# Altium schematic sheet SCH_Wojcik.SchDoc: System kontrolno-pomiarowy pracujący z użyciem łączności ZigBee
size A3; Author: Jagienka Wójcik; DrawnBy: Wójcik Jagienka; SheetNumber: 1; SheetTotal: 1
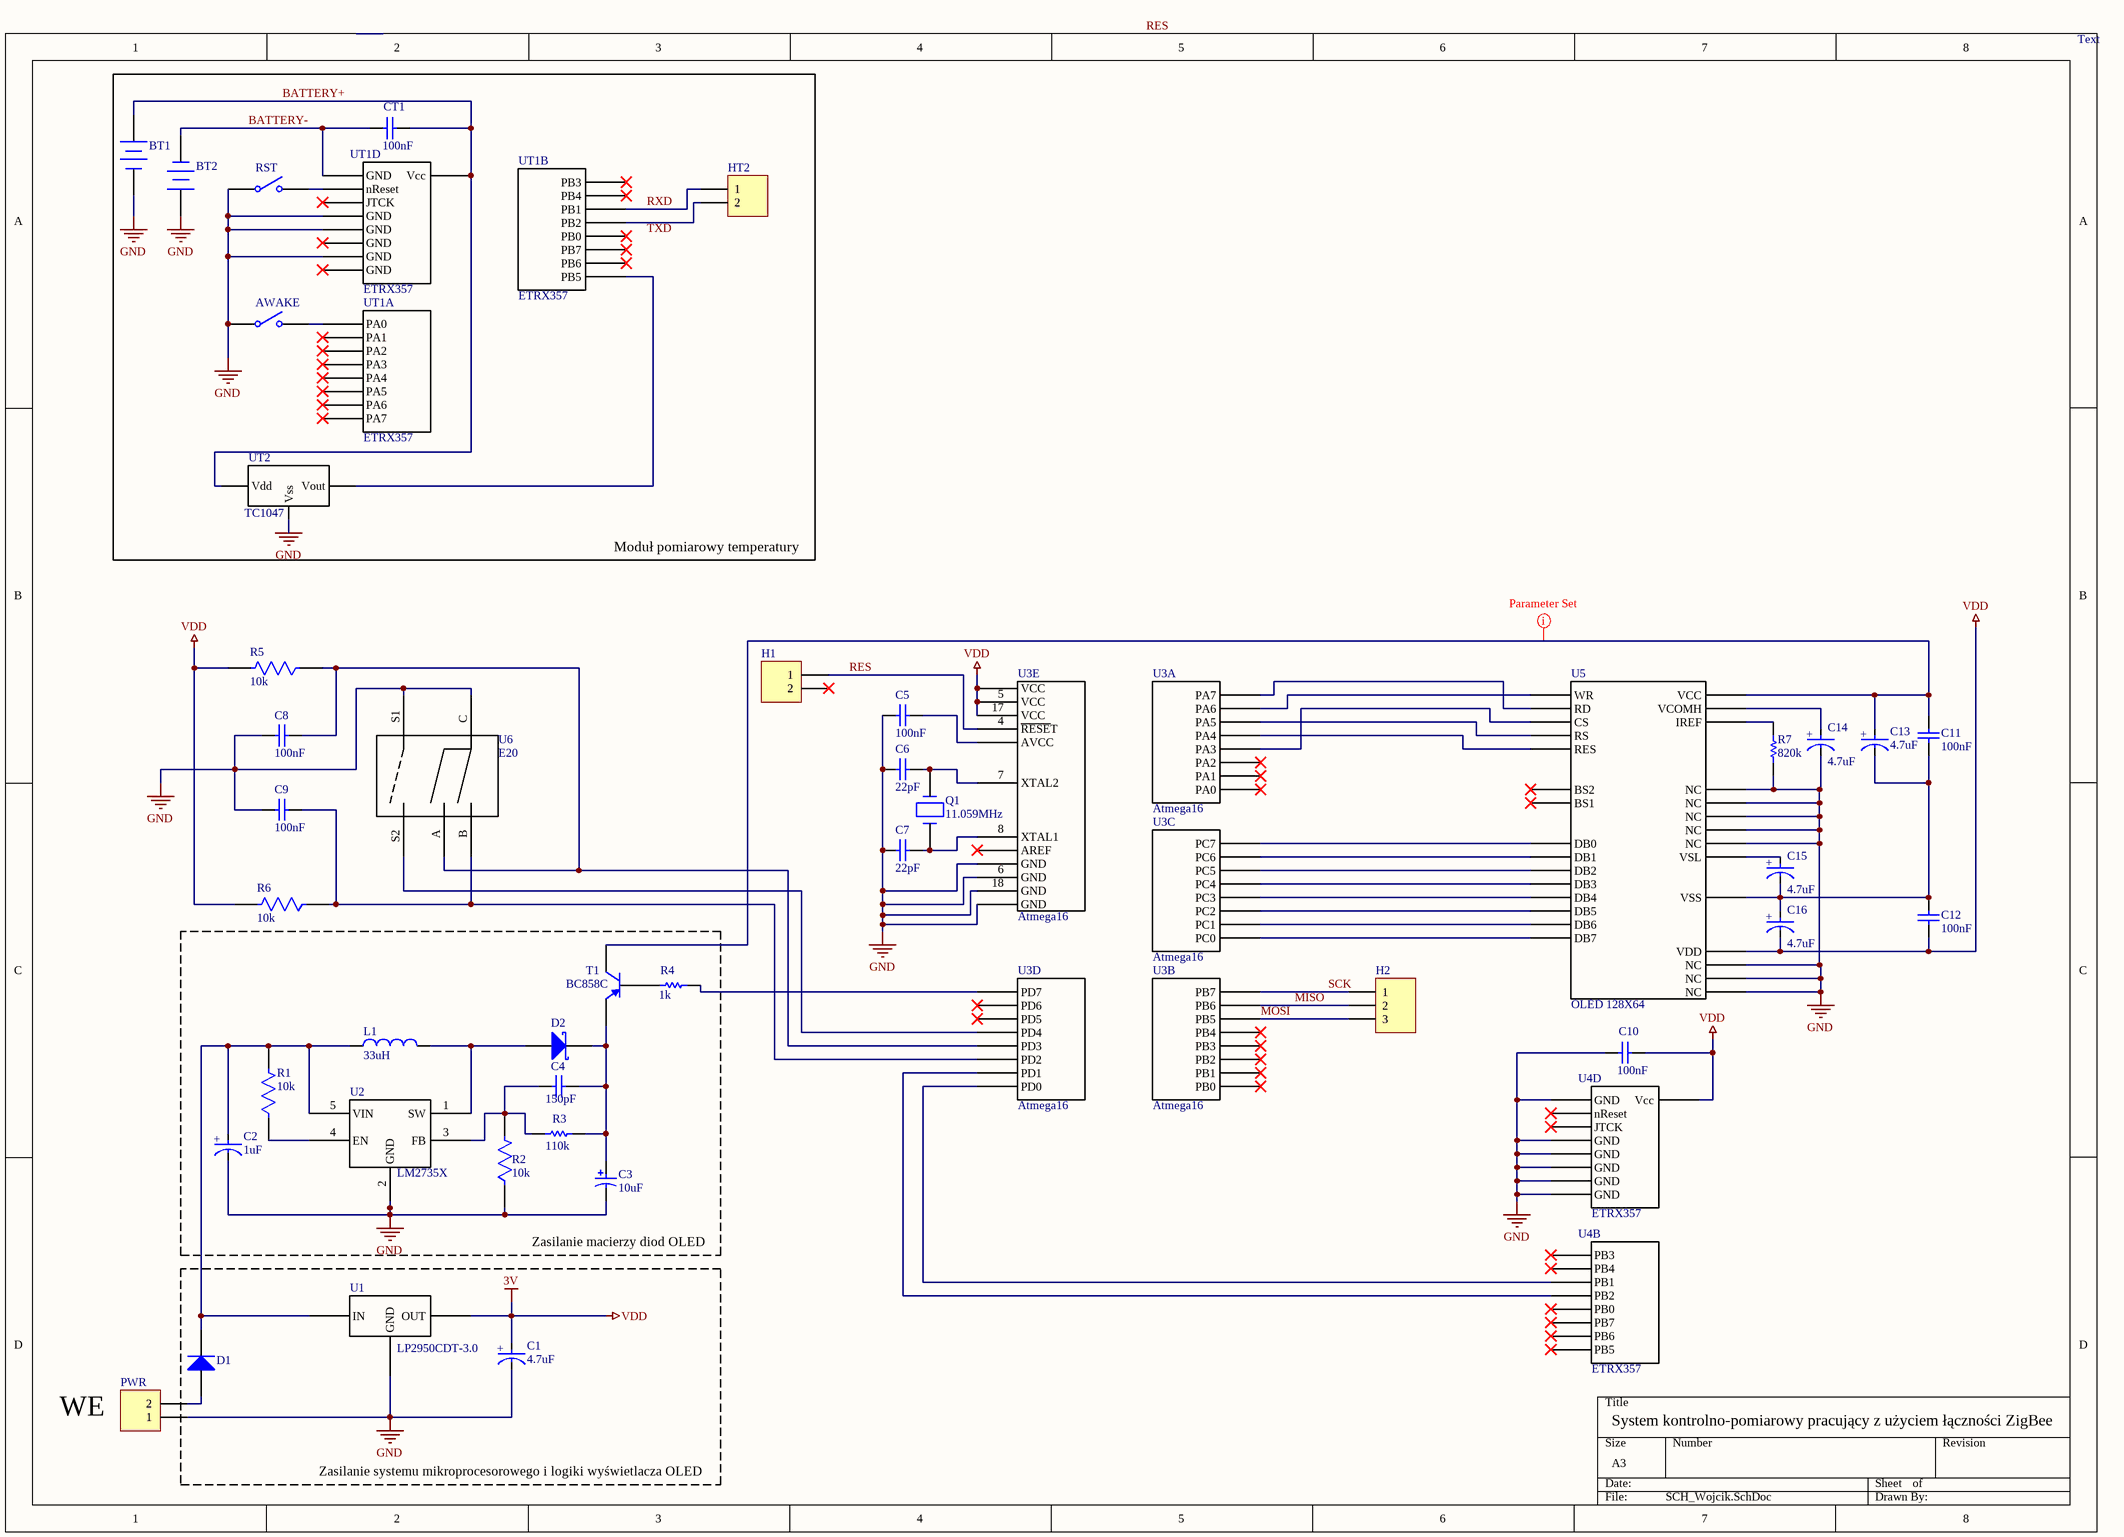
[diagram p0: SCH_Wojcik.SchDoc]

## Parts
AWAKE  (no value)  [SPST-2]
BT1  Battery  [BAT-2]  (value not drawn)
BT2  Battery  [BAT-2]  (value not drawn)
C1  4.7uF  [FP-TAJB-MFG]
C2  1uF  [FP-TAJB-MFG]
C3  10uF  [CAPMP3529X21-T_V]
C4  150pF  [CAPC1608X90X35LL15T15]
C5  100nF  [CAPC1608X90X35LL10T15]
C6  22pF  [CAPC1005X56X25LL10T15]
C7  22pF  [CAPC1005X56X25LL10T15]
C8  100nF  [CAPC1608X90X35LL10T15]
C9  100nF  [CAPC1608X90X35LL10T15]
C10  100nF  [CAPC1608X90X35LL10T15]
C11  100nF  [CAPC1608X90X35LL10T15]
C12  100nF  [CAPC1608X90X35LL10T15]
C13  4.7uF  [FP-TAJB-MFG]
C14  4.7uF  [FP-TAJB-MFG]
C15  4.7uF  [FP-TAJB-MFG]
C16  4.7uF  [FP-TAJB-MFG]
CT1  100nF  [CAPC1608X90X35LL10T15]
D1  Diode 1N5407  [DO-201AD]  (value not drawn)
D2  D Schottky  [SMB]  (value not drawn)
H1  Header 2  [HDR1X2]  (value not drawn)
H2  Header 3  [HDR1X3]  (value not drawn)
HT2  Header 2  [HDR1X2]  (value not drawn)
L1  33uH  [WE-PD4-L]
PWR  Header 2  [HDR1X2]  (value not drawn)
Q1  11.059MHz  [XTAL_ABLS2-11.059MHZ-B4Y-T]
R1  10k  [FP-CRCW0402-e3-IPC_A]
R2  10k  [FP-CRCW0402-e3-IPC_A]
R3  110k  [RESC1005X40X25LL05T05]
R4  1k  [RESC2013X50X30LL20T20]
R5  10k  [FP-CRCW0402-e3-IPC_A]
R6  10k  [FP-CRCW0402-e3-IPC_A]
R7  820k  [RESC1005X40X25NL05T05]
RST  (no value)  [SPST-2]
T1  BC858C  [INF-SOT23_L]
U1  LP2950CDT-3.0  [ON_Semi_369C_0]
U2  LM2735X  [SOT95P280X145-5N]
U3  Atmega16  [44A_L]  (parts A,B,C,D,E of 5)
U4  ETRX357  [ETRX357]  (parts B,D of 4)
U5  OLED 128X64
U6  E20  [Encoder]
UT1  ETRX357  [ETRX357]  (parts A,B,D of 4)
UT2  TC1047  [SOT-23]

## Blocks framed on the sheet
Moduł pomiarowy temperatury: AWAKE BT1 BT2 CT1 HT2 RST UT1 UT2
Zasilanie macierzy diod OLED: C2-C4 D2 L1 R1-R4 T1 U2

## Nets
3V: C1.2(A) C10.2 C12.1 C16.1(C) R5.2 R6.2 U1.3(OUT) U3.5(VCC) U3.17(VCC) U3.38(VCC) U4.32(Vcc) U5.21(VDD)  [also labelled VDD]
GND: AWAKE.1(COMMON) BT1.2(-) BT2.1(+) C1.1(C) C2.1(C) C3.2 C5.1 C6.1 C7.1 C8.1 C9.1 C10.1 C14.1(C) PWR.1 R2.1 R7.1 RST.1(COMMON) U1.2(GND) U2.2(GND) U3.6(GND) U3.18(GND) U3.28(GND) U3.39(GND) U4.1(GND) U4.13(GND) U4.19(GND) U4.20(GND) U4.31(GND) U4.33(GND) U5.18(NC) U5.22(NC) U5.23(NC) U5.24(NC) U5.25(NC) U5.26(NC) U5.27(NC) U5.28(NC) U6.C U6.S1 UT1.13(GND) UT1.20(GND) UT1.33(GND) UT2.3(Vss)
BATTERY+: BT1.1(+) CT1.2 UT1.32(Vcc) UT2.1(Vdd)
BATTERY-: BT2.2(-) CT1.1 UT1.1(GND)
MISO: H2.2 U3.2(PB6)
MOSI: H2.3 U3.1(PB5)
RES: H1.1 U3.4(~{RESE}T)
RXD: HT2.1 UT1.17(PB1)
SCK: H2.1 U3.3(PB7)
NetAWAKE_2: AWAKE.2(NO) UT1.9(PA0)
NetC2_2: C2.2(A) D1.2(K) L1.1 R1.2 U1.1(IN) U2.5(VIN)
NetC3_1: C3.1 C4.2 D2.2(K) R3.2 T1.2(E)
NetC4_1: C4.1 R2.2 R3.1 U2.3(FB)
NetC5_2: C5.2 U3.27(AVCC)
NetC6_2: C6.2 Q1.2 U3.7(XTAL2)
NetC7_2: C7.2 Q1.1 U3.8(XTAL1)
NetC8_2: C8.2 R5.1 U3.17(PD3) U6.A
NetC9_2: C9.2 R6.1 U3.11(PD2) U6.B
NetC11_1: C11.1 C12.2 C13.1(C) C15.1(C) C16.2(A) U5.29(VSS)
NetC11_2: C11.2 C13.2(A) T1.3(C) U5.2(VCC)
NetC14_2: C14.2(A) U5.3(VCOMH)
NetC15_2: C15.2(A) U5.30(VSL)
NetD1_1: D1.1(A) PWR.2
NetD2_1: D2.1(A) L1.2 U2.1(SW)
NetHT2_2: HT2.2 UT1.18(PB2)
NetR1_1: R1.1 U2.4(EN)
NetR4_1: R4.1 T1.1(B)
NetR4_2: R4.2 U3.16(PD7)
NetR7_2: R7.2 U5.4(IREF)
NetRST_2: RST.2(NO) UT1.7(nReset)
NetU3_9: U3.9(PD0) U4.17(PB1)
NetU3_10: U3.10(PD1) U4.18(PB2)
NetU3_12: U3.12(PD4) U6.S2
NetU3_19: U3.19(PC0) U5.5(DB7)
NetU3_20: U3.20(PC1) U5.6(DB6)
NetU3_21: U3.21(PC2) U5.7(DB5)
NetU3_22: U3.22(PC3) U5.8(DB4)
NetU3_23: U3.23(PC4) U5.9(DB3)
NetU3_24: U3.24(PC5) U5.10(DB2)
NetU3_25: U3.25(PC6) U5.11(DB1)
NetU3_26: U3.26(PC7) U5.12(DB0)
NetU3_30: U3.30(PA7) U5.13(RD)
NetU3_31: U3.31(PA6) U5.14(WR)
NetU3_32: U3.32(PA5) U5.17(RS)
NetU3_33: U3.33(PA4) U5.26(RES)
NetU3_34: U3.34(PA3) U5.15(CS)
NetUT1_30: UT1.30(PB5) UT2.2(Vout)

Not connected (* = marked no-connect by the designer): H1 2*; U3 14(PD5)* 15(PD6)* 29(AREF)* 35(PA2)* 36(PA1)* 37(PA0)* 40(PB0)* 41(PB1)* 42(PB2)* 43(PB3)* 44(PB4)*; U4 6(PB3)* 7(nReset)* 8(PB4)* 21(JTCK)* 25(PB0)* 28(PB7)* 29(PB6)* 30(PB5)*; U5 19(BS2)* 20(BS1)*; UT1 5(PA7)* 6(PB3)* 8(PB4)* 10(PA1)* 11(PA2)* 12(PA3)* 14(PA4)* 15(PA5)* 16(PA6)* 19(GND)* 21(JTCK)* 25(PB0)* 28(PB7)* 29(PB6)* 31(GND)*

## Layout directives
rule Width Constraint [Pref Width = 12mil    Min Width = 6mil    Max Width = 50mil]: NetC11_2

## Notes on the sheet
- Text
- WE
- Zasilanie systemu mikroprocesorowego i logiki wyświetlacza OLED
- System kontrolno-pomiarowy pracujący z użyciem łączności ZigBee
- Labels drawn without touching a wire or pin: RES, TXD
- (in symbol 1uF) +
- (in symbol cap4.7u) +

## Library data of the parts
AWAKE RST = SW-SPST: Single-Pole, Single-Throw Switch; Published: 24-Mar-1999; LatestRevisionDate: 17-Jul-2002; LatestRevisionNote: Re-released for DXP Platform.; PackageReference: SPST-2; Publisher: Altium Limited; PackageDescription: Switch; 2 Leads
BT1 BT2 = Battery: Multicell Battery; Published: 24-Mar-1999; LatestRevisionDate: 17-Jul-2002; LatestRevisionNote: Re-released for DXP Platform.; PackageReference: BAT-2; Publisher: Altium Limited; PackageDescription: Battery; 2 Leads
C1 C13-C16 = cap4.7u: CAP TANT 4.7UF 10% 10V 1411; Manufacturer: AVX Corporation; Manufacturer Part Number: TAJB475K010RNJ; Life: 1000Hours; Material: Tantalum; Ripple Current: 146mA; Esr: 4Ω; Dissipation Factor: 6%; Footprint Url: https://www.avx.com/docs/techinfo/TechSumAppGuide.pdf; Category: Cap; Device Class L1: Passive Components; ComponentLink2URL: http://datasheets.avx.com/TAJ.pdf; Height: 2.1mm; RoHS: TRUE; Automotive: No; Value: 4.7uF; Temperature: -55°C to +125°C; Lead Free: Yes; Digikey Description: CAP TANT 4.7UF 10% 10V 1411; Voltage Rating: 10V; Package: TAJB; Device Class L2: Capacitors; Mouser Description: Cap Tant Solid 4.7uF 10V B CASE 10% (3.5 X 2.8 X 1.9mm) SMD 3528-21 4 Ohm 125 C T/R; ComponentLink2Description: Datasheet; Device Class L3: Tantalum Capacitors; Tolerance: 10%; Temperature Range High: +125°C; Temperature Range Low: -55°C; Octopart: https://octopart.com/tajb475k010rnj-avx-2636133; Capacitance: 4.7uF
C2 = 1uF: CAP TANT 1UF 10% 35V 1411; Dielectric Material: Tantalum; Dissipation Factor: 4%; ESR (Equivalent Series Resistance): 6.5R; Q Factor: 4; Leakage Current: 500nA; Polarity: Polar; Case Code (Metric): 3528; Tolerance: 10%; Length: 3.5mm; Voltage Rating: 35V; RoHS Compliant: Yes; Height: 1.9mm; Packaging: Tape and Reel; Max Operating Temperature: 125°C; REACH SVHC: No SVHC; Lead Free: Lead Free; Series: TAJ; Capacitance: 1uF; Package Quantity: 1; Voltage Rating (DC): 35V; Height - Seated (Max): 0.083inch; Construction: Flat; Mount: Surface Mount; Case/Package: 1210; Features: General Purpose; Voltage: 35V; Min Operating Temperature: -55°C; Radiation Hardening: No; Case Code (Imperial): 1210; Width: 2.8mm; Number of Pins: 2; Depth: 2.8mm; Termination: SMD/SMT; Lead Pitch: 1.4mm
C3 = 10uF: Standard Tantalum, 10 uF, +/- 20%, 20 V, -55 to 125 degC, 2-Pin SMD, RoHS, Tape and Reel; Manufacturer: AVX; ESR: 2.1ohm; DCL: 2uA; Case Style: Molded; DF: 6%; Product Height (mm): 1.9mm; Lead Spacing (nom): NotRequiredmm; Wire Form: NotRequired; Rad Hardened: No; Capacitance: 10000000pF; Product Depth (mm): 2.8mm; Polarity: Polar; Voltage: 20VDC; Product Length (mm): 3.5mm; Mounting Technology: SurfaceMount; Length W/Weld: NotRequiredmm; Datasheet URL: http://datasheets.avx.com/TAJ.pdf; Tolerance (+ or -): 20%; Operating Temp Range: -55Cto125C; Datasheet Version: 02/2016; Product Diameter (mm): NotRequiredmm; Manufacturer URL: http://www.avx.com/; Package Reference: CAPMP3529X21-T; Length W/Weld (max): NotRequiredmm; Insulation: NotRequired; Package / Case: 3528-21; Seal: NotRequired; Package URL: http://www.avx.com/download/software/literature/AVX-Footprint-Library.pdf; Construction: SMTChip; Packaging: TapeandReel; Package Description: 2-Pin Surface Mount Device, Body 3.5 x 2.85 mm; Case Code: B; Failure Rate: NotRequired; Seated Plane Height: NotRequiredmm; Mounting Style: SurfaceMount
C4 = 150pF: Manufacturer: Kemet; Part Number: C0603C151J5GAC7867
C5 C8-C12 CT1 = cap100n: Chip Capacitor, 0.1 uF, +/- 10%, 50 V, -55 to 125 degC, 0603 (1608 Metric), RoHS, Tape and Reel; Manufacturer: Murata; Dielectric Material: Ceramic; Voltage Rating: 50V; Dielectric: X7R; Insulation Resistance: 10GR; Case Code (Metric): 1608; Lead Free: LeadFree; Depth: 0.8mm; Number of Pins: 2; Radiation Hardening: No; Case/Package: 0603; Manufacturer URL: http://www.murata.com/; Packaging: TapeandReel; Length: 1.6mm; Contact Plating: Tin; Datasheet URL: http://psearch.en.murata.com/capacitor/product/GRM188R71H104KA93%23.pdf; Tolerance: 10%; Case Code (Imperial): 0603; Min Operating Temperature: -55degC; RoHSCompliant: true; Capacitance: 100nF; Voltage: 50V; Termination: SMD/SMT; Mount: SurfaceMount; Material: Ceramic; Package Quantity: 1; Height: 0.8mm; Thickness: 0.035inch; REACH SVHC: NoSVHC; Max Operating Temperature: 125degC; Width: 0.8mm; Package Reference: 0603; Voltage Rating (DC): 50V; Datasheet Version: 42675.0; Package Description: 2-Pin Surface Mount Device, Body 1.6 x 0.8 mm
C6 C7 = 22pF: Part Number: 04025A220JAT2A; Manufacturer: AVX Interconnect / Elco
D1 = Diode 1N5407: 3 Amp Medium Power Silicon Rectifier Diode; Published: 8-Jun-2000; LatestRevisionDate: 17-Jul-2002; LatestRevisionNote: Re-released for DXP Platform.; DatasheetVersion: Aug-1984; PackageReference: DO-201AD; Publisher: Altium Limited; PackageDescription: Diode, Axial; Body 9.5 x 5.3 mm (LxDia. max), Lead Dia. 1.32 mm (max); ComponentLink1Description: Manufacturer Link; ComponentLink1URL: http://www.irf.com/
D2 = D Schottky: Schottky Diode; Published: 8-Jun-2000; LatestRevisionDate: 17-Jul-2002; LatestRevisionNote: Re-released for DXP Platform.; PackageReference: SMB; Publisher: Altium Limited; PackageDescription: DO-214-AA/SMB; 2 C-Bend Leads; Body 5.3 x 3.6 mm, inc. leads (LxW); Code_JEDEC: DO-214-AA
H1 HT2 PWR = Header 2: Header, 2-Pin; LatestRevisionDate: 17-Jul-2002; LatestRevisionNote: Re-released for DXP Platform.; Publisher: Altium Limited
H2 = Header 3: Header, 3-Pin; LatestRevisionDate: 17-Jul-2002; LatestRevisionNote: Re-released for DXP Platform.; Publisher: Altium Limited
L1 = CMP-0227-00804-1: SMD-Power Inductor WE-PD4, L = 33.0 µH; Inductance: 33.0 ÂµH; ComponentLink2Description: Datasheet; DatasheetVersion: ver 2, Sep-2006; ComponentLink2URL: http://www.we-online.de/katalog/media/pdf/74456133.pdf; ComponentLink1Description: Manufacturer Link; PackageReference: WE-PD4-L; PackageVersion: 2006; PackageDescription: SMD Inductor, 2-Leads, Body 12.7 x 10.0 mm; ComponentLink1URL: http://www.we-online.com
Q1 = ABLS2-11.059MHZ-B4Y-T: 11.059MHz Â±30ppm Crystal 18pF 50 Ohms HC-49/US; MF: Abracon; Digi-Key_Part_Number: ABLS2-11.059MHZ-B4Y-T-ND; SnapEDA_Link: https://www.snapeda.com/parts/ABLS2-11.059MHZ-B4Y-T/Abracon%20LLC/view-part/481443/?ref=snap; Package: HC49/US Abracon; MP: ABLS2-11.059MHZ-B4Y-T; Value: *; Digi-Key_Purchase_URL: https://www.digikey.com/product-detail/en/abracon-llc/ABLS2-11.059MHZ-B4Y-T/ABLS2-11.059MHZ-B4Y-T-ND/4866046?utm_source=snapeda&utm_medium=aggregator&utm_campaign=symbol
R1 R2 R5 R6 = 10k: RES SMD 10K OHM 1% 1/16W 0402; Power Rating: 63mW; Resistance: 10kR; Voltage Rating: 50V; Temperature Coefficient: 100ppm/°C; Case Code (Metric): 1005; Features: Automotive AEC-Q200; Termination: SMD/SMT; Mount: Surface Mount; Package Quantity: 10; Packaging: Tape and Reel; Case Code (Imperial): 0402; Weight: 2.3E-05oz; Lead Free: Lead Free; Width: 0.02inch; Max Power Dissipation: 63mW; Tolerance: 1%; Number of Terminations: 2; Height: 0.35mm; Number of Pins: 2; Composition: Thick Film; Length: 1mm; Voltage Rating (DC): 50V; Case/Package: 0402; Radiation Hardening: No; Contact Plating: Tin; Depth: 0.5mm; Military Standard: Not; Min Operating Temperature: -55°C; Max Operating Temperature: 155°C
R3 = 110k: Manufacturer: Vishay Dale; Part Number: CRCW0402110KFKED
R4 = 1k: Part Number: CRCW08051K00FKEA; Manufacturer: Vishay Dale
R7 = 820k: Part Number: CRCW0402820KFKED; Manufacturer: Vishay Dale
T1 = CMP-1177-00041-1: PNP Silicon AF Transistor, 30 V VCEO, 100 mA IC, SOT23, Reel, Green; Manufacturer: Infineon; VCBO (max): 30Â V; VEBO (max): 5Â V; ICM (max): 200Â mA; Ptot (max): 330Â mW; Green: TRUE; fT (typ): 250Â MHz; IC (max): 100Â mA; ICBO (max): 15Â nA; ComponentLink1URL: http://www.infineon.com/; VCEO (max): 30Â V; ComponentLink1Description: Manufacturer URL; PartNumber: BC858C; ComponentLink3URL: http://www.infineon.com/dgdl/SOT23-Package_Overview.pdf?folderId=db3a30431936bc4b0119532290053c66&fileId=db3a30431936bc4b0119533468123c85; Mounting Technology: Surface Mount; PackageVersion: Apr-08; ComponentLink2Description: Datasheet; PackageReference: SOT23; ComponentLink3Description: Package Specification; ComponentLink2URL: http://www.infineon.com/dgdl/bc857series_bc858series_bc859series_bc860series.pdf?folderId=db3a304314dca389011541d30fa21656&fileId=db3a304314dca389011541da0e3a1661; PackageDescription: 3-Pin Small Outline Transistor Package, 1.3 x 2.9 mm Body, 0.95 mm Pitch; IBM (max): 200Â mA; Polarity: PNP; Packing: Reel
U5 = OLED